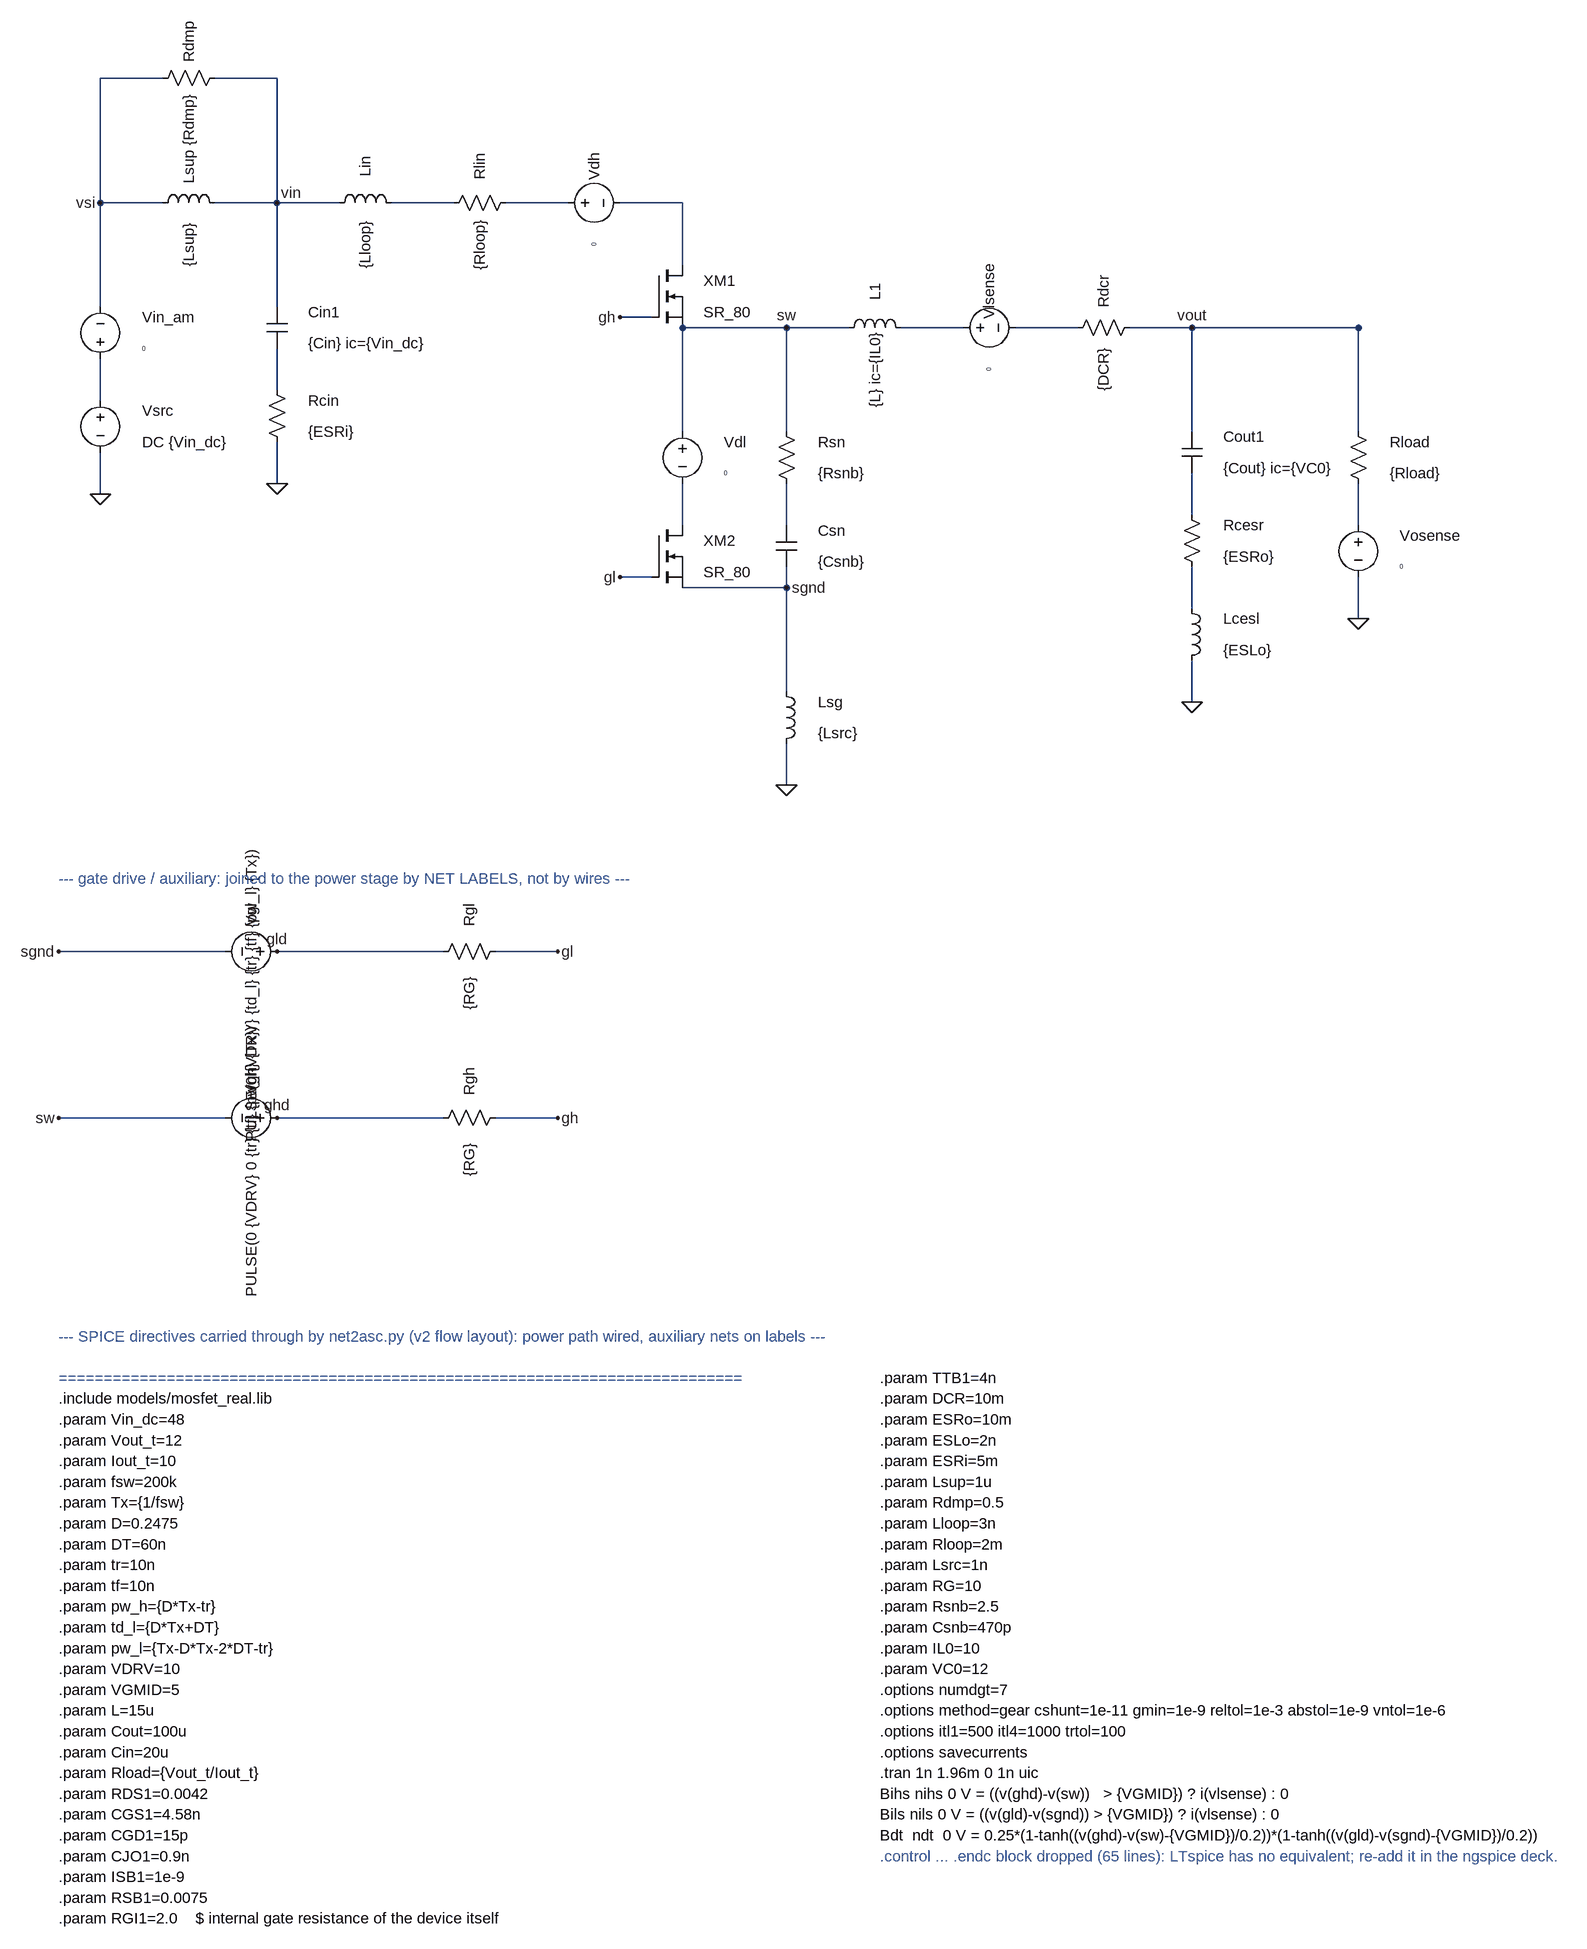
[diagram p0: schematic corrupt_E_spiceline.asc]
corrupt_E_spiceline.asc, the LTspice schematic file:
Version 4
SHEET 1 3104 3136
WIRE 976 480 928 480
WIRE 1024 304 1024 400
WIRE 1024 304 928 304
WIRE 848 304 752 304
WIRE 672 304 576 304
WIRE 496 304 400 304
WIRE 1024 496 1184 496
WIRE 1024 496 1024 592
WIRE 1024 592 1024 656
WIRE 1024 736 1024 800
WIRE 1024 896 1184 896
WIRE 976 880 928 880
WIRE 1184 496 1184 592
WIRE 1184 592 1184 656
WIRE 1184 736 1184 800
WIRE 1184 864 1184 896
WIRE 1184 496 1280 496
WIRE 1360 496 1456 496
WIRE 1536 496 1632 496
WIRE 1712 496 1808 496
WIRE 1808 496 1808 592
WIRE 1808 592 1808 656
WIRE 1808 720 1808 784
WIRE 1808 864 1808 928
WIRE 1808 1008 1808 1072
WIRE 1808 496 2064 496
WIRE 2064 496 2064 592
WIRE 2064 592 2064 656
WIRE 2064 736 2064 800
WIRE 2064 880 2064 944
WIRE 1808 496 2064 496
WIRE 1184 896 1184 992
WIRE 1184 992 1184 1056
WIRE 1184 1136 1184 1200
WIRE 400 304 400 400
WIRE 400 400 400 464
WIRE 400 528 400 592
WIRE 400 672 400 736
WIRE 400 304 304 304
WIRE 224 304 128 304
WIRE 128 304 128 112
WIRE 128 112 224 112
WIRE 304 112 400 112
WIRE 400 112 400 304
WIRE 128 304 128 400
WIRE 128 400 128 464
WIRE 128 544 128 608
WIRE 128 688 128 752
WIRE 64 1456 320 1456
WIRE 400 1456 656 1456
WIRE 736 1456 832 1456
WIRE 64 1712 320 1712
WIRE 400 1712 656 1712
WIRE 736 1712 832 1712
FLAG 928 480 gh
FLAG 928 880 gl
FLAG 400 304 vin
FLAG 1184 496 sw
FLAG 1184 896 sgnd
FLAG 1808 496 vout
FLAG 1808 1072 0
FLAG 2064 944 0
FLAG 1184 1200 0
FLAG 400 736 0
FLAG 128 304 vsi
FLAG 128 752 0
FLAG 64 1456 sgnd
FLAG 832 1456 gl
FLAG 64 1712 sw
FLAG 832 1712 gh
FLAG 400 1712 ghd
FLAG 400 1456 gld
SYMBOL nmos 976 400 R0
WINDOW 0 80 24 Left 2
WINDOW 3 80 72 Left 2
SYMATTR InstName XM1
SYMATTR Value SR_80
SYMATTR SpiceLine RDSON={RDS1} VTH=3.0 VDRV={VDRV} RGATE={RGI1} CGS={CGS1} CGD={CGD1} CJO={CJO1} VJ=0.7 MJ=0.5 ISB={ISB1} RSB={RSB1} NB=1 TTB={TTB1} BVB=80
SYMBOL voltage 832 304 R270
WINDOW 0 56 56 Center 2
WINDOW 3 -64 56 Center 0
SYMATTR InstName Vdh
SYMATTR Value 0
SYMBOL res 656 320 R270
WINDOW 0 72 56 Center 2
WINDOW 3 -48 56 Center 2
SYMATTR InstName Rlin
SYMATTR Value {Rloop}
SYMBOL ind 480 320 R270
WINDOW 0 72 56 Center 2
WINDOW 3 -48 56 Center 2
SYMATTR InstName Lin
SYMATTR Value {Lloop}
SYMBOL voltage 1024 640 R0
WINDOW 0 64 32 Left 2
WINDOW 3 64 80 Left 0
SYMATTR InstName Vdl
SYMATTR Value 0
SYMBOL nmos 976 800 R0
WINDOW 0 80 24 Left 2
WINDOW 3 80 72 Left 2
SYMATTR InstName XM2
SYMATTR Value SR_80
SYMATTR SpiceLine RDSON={RDS1} VTH=3.0 VDRV={VDRV} RGATE={RGI1} CGS={CGS1} CGD={CGD1} CJO={CJO1} VJ=0.7 MJ=0.5 ISB={ISB1} RSB={RSB1} NB=1 TTB={TTB1} BVB=80
SYMBOL res 1168 640 R0
WINDOW 0 64 32 Left 2
WINDOW 3 64 80 Left 2
SYMATTR InstName Rsn
SYMATTR Value {Rsnb}
SYMBOL cap 1168 800 R0
WINDOW 0 64 8 Left 2
WINDOW 3 64 56 Left 2
SYMATTR InstName Csn
SYMATTR SpiceLine Rpar=0.001
SYMATTR Value {Csnb}
SYMBOL ind 1264 512 R270
WINDOW 0 72 56 Center 2
WINDOW 3 -48 56 Center 2
SYMATTR InstName L1
SYMATTR Value {L} ic={IL0}
SYMBOL voltage 1440 496 R270
WINDOW 0 56 56 Center 2
WINDOW 3 -64 56 Center 0
SYMATTR InstName Vlsense
SYMATTR Value 0
SYMBOL res 1616 512 R270
WINDOW 0 72 56 Center 2
WINDOW 3 -48 56 Center 2
SYMATTR InstName Rdcr
SYMATTR Value {DCR}
SYMBOL cap 1792 656 R0
WINDOW 0 64 8 Left 2
WINDOW 3 64 56 Left 2
SYMATTR InstName Cout1
SYMATTR Value {Cout} ic={VC0}
SYMBOL res 1792 768 R0
WINDOW 0 64 32 Left 2
WINDOW 3 64 80 Left 2
SYMATTR InstName Rcesr
SYMATTR Value {ESRo}
SYMBOL ind 1792 912 R0
WINDOW 0 64 32 Left 2
WINDOW 3 64 80 Left 2
SYMATTR InstName Lcesl
SYMATTR Value {ESLo}
SYMBOL res 2048 640 R0
WINDOW 0 64 32 Left 2
WINDOW 3 64 80 Left 2
SYMATTR InstName Rload
SYMATTR Value {Rload}
SYMBOL voltage 2064 784 R0
WINDOW 0 64 32 Left 2
WINDOW 3 64 80 Left 0
SYMATTR InstName Vosense
SYMATTR Value 0
SYMBOL ind 1168 1040 R0
WINDOW 0 64 32 Left 2
WINDOW 3 64 80 Left 2
SYMATTR InstName Lsg
SYMATTR Value {Lsrc}
SYMBOL cap 384 464 R0
WINDOW 0 64 8 Left 2
WINDOW 3 64 56 Left 2
SYMATTR InstName Cin1
SYMATTR Value {Cin} ic={Vin_dc}
SYMBOL res 384 576 R0
WINDOW 0 64 32 Left 2
WINDOW 3 64 80 Left 2
SYMATTR InstName Rcin
SYMATTR Value {ESRi}
SYMBOL ind 208 320 R270
WINDOW 0 72 56 Center 2
WINDOW 3 -48 56 Center 2
SYMATTR InstName Lsup
SYMATTR Value {Lsup}
SYMBOL res 208 128 R270
WINDOW 0 72 56 Center 2
WINDOW 3 -48 56 Center 2
SYMATTR InstName Rdmp
SYMATTR Value {Rdmp}
SYMBOL voltage 128 560 R180
WINDOW 0 -64 80 Right 2
WINDOW 3 -64 32 Right 0
SYMATTR InstName Vin_am
SYMATTR Value 0
SYMBOL voltage 128 592 R0
WINDOW 0 64 32 Left 2
WINDOW 3 64 80 Left 2
SYMATTR InstName Vsrc
SYMATTR Value DC {Vin_dc}
SYMBOL voltage 416 1456 R90
WINDOW 0 -56 56 Center 2
WINDOW 3 64 56 Center 2
SYMATTR InstName Vgl
SYMATTR Value PULSE(0 {VDRV} {td_l} {tr} {tf} {pw_l} {Tx})
SYMBOL res 640 1472 R270
WINDOW 0 72 56 Center 2
WINDOW 3 -48 56 Center 2
SYMATTR InstName Rgl
SYMATTR Value {RG}
SYMBOL voltage 416 1712 R90
WINDOW 0 -56 56 Center 2
WINDOW 3 64 56 Center 2
SYMATTR InstName Vgh
SYMATTR Value PULSE(0 {VDRV} 0 {tr} {tf} {pw_h} {Tx})
SYMBOL res 640 1728 R270
WINDOW 0 72 56 Center 2
WINDOW 3 -48 56 Center 2
SYMATTR InstName Rgh
SYMATTR Value {RG}
TEXT 64 1344 Left 2 ;--- gate drive / auxiliary: joined to the power stage by NET LABELS, not by wires ---
TEXT 64 2048 Left 2 ;--- SPICE directives carried through by net2asc.py (v2 flow layout): power path wired, auxiliary nets on labels ---
TEXT 64 2112 Left 2 ;============================================================================
TEXT 64 2144 Left 2 !.include models/mosfet_real.lib
TEXT 64 2176 Left 2 !.param Vin_dc=48
TEXT 64 2208 Left 2 !.param Vout_t=12
TEXT 64 2240 Left 2 !.param Iout_t=10
TEXT 64 2272 Left 2 !.param fsw=200k
TEXT 64 2304 Left 2 !.param Tx={1/fsw}
TEXT 64 2336 Left 2 !.param D=0.2475
TEXT 64 2368 Left 2 !.param DT=60n
TEXT 64 2400 Left 2 !.param tr=10n
TEXT 64 2432 Left 2 !.param tf=10n
TEXT 64 2464 Left 2 !.param pw_h={D*Tx-tr}
TEXT 64 2496 Left 2 !.param td_l={D*Tx+DT}
TEXT 64 2528 Left 2 !.param pw_l={Tx-D*Tx-2*DT-tr}
TEXT 64 2560 Left 2 !.param VDRV=10
TEXT 64 2592 Left 2 !.param VGMID=5
TEXT 64 2624 Left 2 !.param L=15u
TEXT 64 2656 Left 2 !.param Cout=100u
TEXT 64 2688 Left 2 !.param Cin=20u
TEXT 64 2720 Left 2 !.param Rload={Vout_t/Iout_t}
TEXT 64 2752 Left 2 !.param RDS1=0.0042
TEXT 64 2784 Left 2 !.param CGS1=4.58n
TEXT 64 2816 Left 2 !.param CGD1=15p
TEXT 64 2848 Left 2 !.param CJO1=0.9n
TEXT 64 2880 Left 2 !.param ISB1=1e-9
TEXT 64 2912 Left 2 !.param RSB1=0.0075
TEXT 64 2944 Left 2 !.param RGI1=2.0    $ internal gate resistance of the device itself
TEXT 1328 2112 Left 2 !.param TTB1=4n
TEXT 1328 2144 Left 2 !.param DCR=10m
TEXT 1328 2176 Left 2 !.param ESRo=10m
TEXT 1328 2208 Left 2 !.param ESLo=2n
TEXT 1328 2240 Left 2 !.param ESRi=5m
TEXT 1328 2272 Left 2 !.param Lsup=1u
TEXT 1328 2304 Left 2 !.param Rdmp=0.5
TEXT 1328 2336 Left 2 !.param Lloop=3n
TEXT 1328 2368 Left 2 !.param Rloop=2m
TEXT 1328 2400 Left 2 !.param Lsrc=1n
TEXT 1328 2432 Left 2 !.param RG=10
TEXT 1328 2464 Left 2 !.param Rsnb=2.5
TEXT 1328 2496 Left 2 !.param Csnb=470p
TEXT 1328 2528 Left 2 !.param IL0=10
TEXT 1328 2560 Left 2 !.param VC0=12
TEXT 1328 2592 Left 2 !.options numdgt=7
TEXT 1328 2624 Left 2 !.options method=gear cshunt=1e-11 gmin=1e-9 reltol=1e-3 abstol=1e-9 vntol=1e-6
TEXT 1328 2656 Left 2 !.options itl1=500 itl4=1000 trtol=100
TEXT 1328 2688 Left 2 !.options savecurrents
TEXT 1328 2720 Left 2 !.tran 1n 1.96m 0 1n uic
TEXT 1328 2752 Left 2 !Bihs nihs 0 V = ((v(ghd)-v(sw))   > {VGMID}) ? i(vlsense) : 0
TEXT 1328 2784 Left 2 !Bils nils 0 V = ((v(gld)-v(sgnd)) > {VGMID}) ? i(vlsense) : 0
TEXT 1328 2816 Left 2 !Bdt  ndt  0 V = 0.25*(1-tanh((v(ghd)-v(sw)-{VGMID})/0.2))*(1-tanh((v(gld)-v(sgnd)-{VGMID})/0.2))
TEXT 1328 2848 Left 2 ;.control ... .endc block dropped (65 lines): LTspice has no equivalent; re-add it in the ngspice deck.

The netlist it stands for:
* corrupt_E_spiceline.asc
M§XM1 N001 gh sw sw SR_80 RDSON={RDS1} VTH=3.0 VDRV={VDRV} RGATE={RGI1} CGS={CGS1} CGD={CGD1} CJO={CJO1} VJ=0.7 MJ=0.5 ISB={ISB1} RSB={RSB1} NB=1 TTB={TTB1} BVB=80
Vdh N002 N001 0
Rlin N003 N002 {Rloop}
Lin vin N003 {Lloop}
Vdl sw N004 0
M§XM2 N004 gl sgnd sgnd SR_80 RDSON={RDS1} VTH=3.0 VDRV={VDRV} RGATE={RGI1} CGS={CGS1} CGD={CGD1} CJO={CJO1} VJ=0.7 MJ=0.5 ISB={ISB1} RSB={RSB1} NB=1 TTB={TTB1} BVB=80
Rsn sw N005 {Rsnb}
Csn N005 sgnd {Csnb} Rpar=0.001
L1 sw N006 {L} ic={IL0}
Vlsense N006 N007 0
Rdcr N007 vout {DCR}
Cout1 vout N008 {Cout} ic={VC0}
Rcesr N008 N009 {ESRo}
Lcesl N009 0 {ESLo}
Rload vout N010 {Rload}
Vosense N010 0 0
Lsg sgnd 0 {Lsrc}
Cin1 vin N011 {Cin} ic={Vin_dc}
Rcin N011 0 {ESRi}
Lsup vsi vin {Lsup}
Rdmp vsi vin {Rdmp}
Vin_am N012 vsi 0
Vsrc N012 0 DC {Vin_dc}
Vgl gld sgnd PULSE(0 {VDRV} {td_l} {tr} {tf} {pw_l} {Tx})
Rgl gld gl {RG}
Vgh ghd sw PULSE(0 {VDRV} 0 {tr} {tf} {pw_h} {Tx})
Rgh ghd gh {RG}
.model NMOS NMOS
.model PMOS PMOS
.lib standard.mos
* --- gate drive / auxiliary: joined to the power stage by NET LABELS, not by wires ---
* --- SPICE directives carried through by net2asc.py (v2 flow layout): power path wired, auxiliary nets on labels ---
* ============================================================================
.include models/mosfet_real.lib
.param Vin_dc=48
.param Vout_t=12
.param Iout_t=10
.param fsw=200k
.param Tx={1/fsw}
.param D=0.2475
.param DT=60n
.param tr=10n
.param tf=10n
.param pw_h={D*Tx-tr}
.param td_l={D*Tx+DT}
.param pw_l={Tx-D*Tx-2*DT-tr}
.param VDRV=10
.param VGMID=5
.param L=15u
.param Cout=100u
.param Cin=20u
.param Rload={Vout_t/Iout_t}
.param RDS1=0.0042
.param CGS1=4.58n
.param CGD1=15p
.param CJO1=0.9n
.param ISB1=1e-9
.param RSB1=0.0075
.param RGI1=2.0    $ internal gate resistance of the device itself
.param TTB1=4n
.param DCR=10m
.param ESRo=10m
.param ESLo=2n
.param ESRi=5m
.param Lsup=1u
.param Rdmp=0.5
.param Lloop=3n
.param Rloop=2m
.param Lsrc=1n
.param RG=10
.param Rsnb=2.5
.param Csnb=470p
.param IL0=10
.param VC0=12
.options numdgt=7
.options method=gear cshunt=1e-11 gmin=1e-9 reltol=1e-3 abstol=1e-9 vntol=1e-6
.options itl1=500 itl4=1000 trtol=100
.options savecurrents
.tran 1n 1.96m 0 1n uic
Bihs nihs 0 V = ((v(ghd)-v(sw))   > {VGMID}) ? i(vlsense) : 0
Bils nils 0 V = ((v(gld)-v(sgnd)) > {VGMID}) ? i(vlsense) : 0
Bdt  ndt  0 V = 0.25*(1-tanh((v(ghd)-v(sw)-{VGMID})/0.2))*(1-tanh((v(gld)-v(sgnd)-{VGMID})/0.2))
* .control ... .endc block dropped (65 lines): LTspice has no equivalent; re-add it in the ngspice deck.
.backanno
.end